# EAGLE schematic ClockV0.1 (EAGLE 6.5.0)
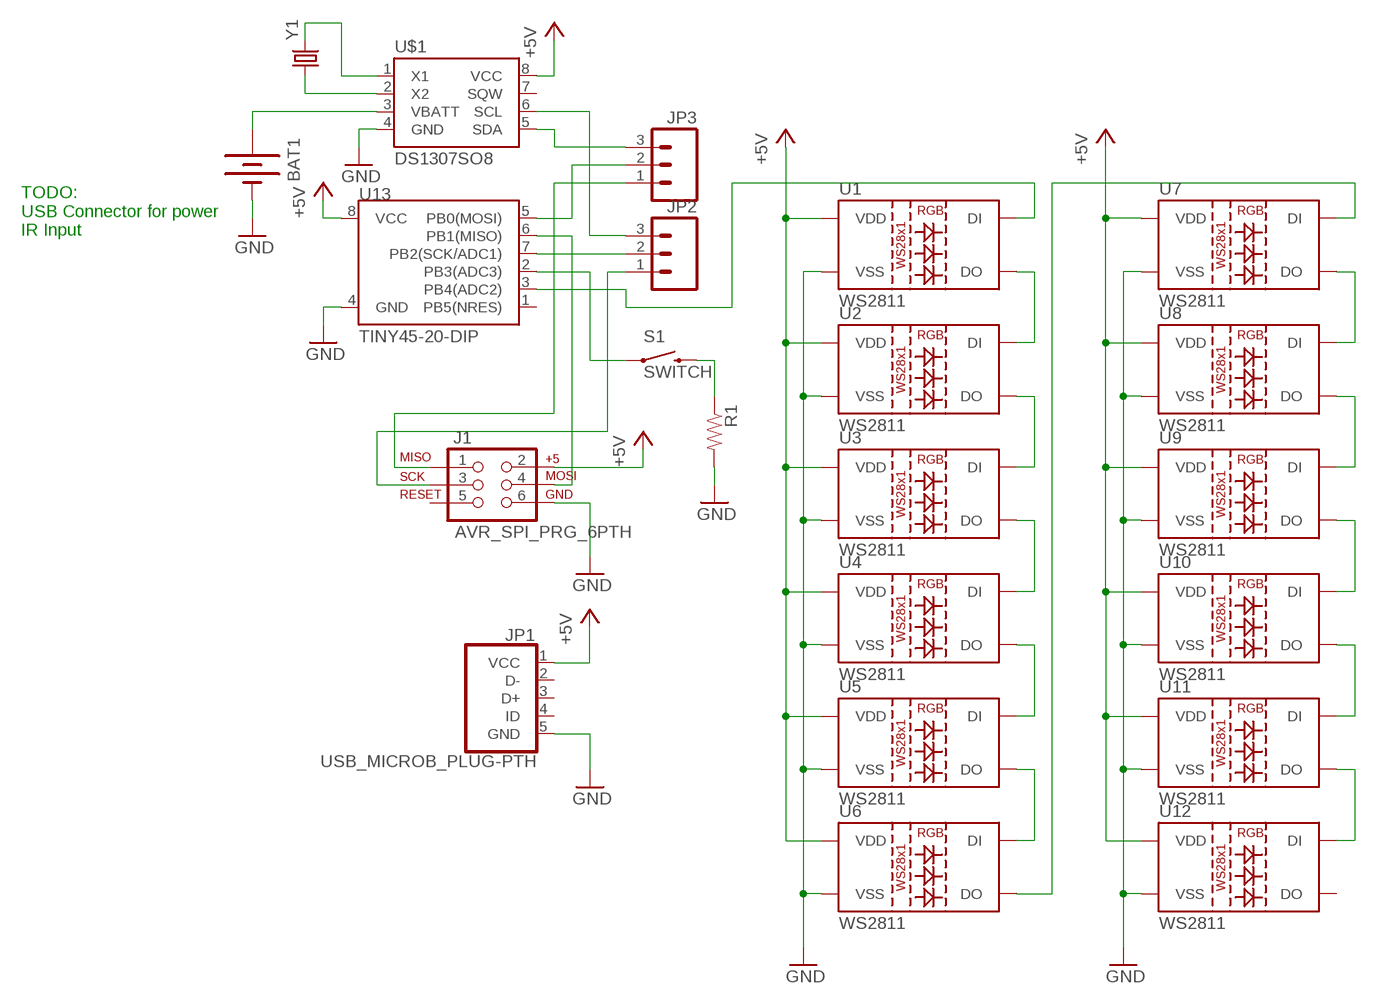
[diagram p0: schematic, sheet 1]

## Parts
BAT1  BATTERY12PTH  [BATTCON_12MM_PTH]
J1  AVR_SPI_PRG_6PTH  [2X3]
JP1  USB_MICROB_PLUG-PTH  [MICRO-B-RA-TH]
JP2  M03PTH  [1X03]
JP3  M03PTH  [1X03]
R1  RESISTORPTH-1/2W  [AXIAL-0.5]
S1  SWITCH  SWITCH-MOMENTARY-2PTH  [TACTILE-PTH]
U1  WS2811  LED-TRICOLOR-5050-ICWS2811  [LED-TRICOLOR-5050-IC]
U2  WS2811  LED-TRICOLOR-5050-ICWS2811  [LED-TRICOLOR-5050-IC]
U3  WS2811  LED-TRICOLOR-5050-ICWS2811  [LED-TRICOLOR-5050-IC]
U4  WS2811  LED-TRICOLOR-5050-ICWS2811  [LED-TRICOLOR-5050-IC]
U5  WS2811  LED-TRICOLOR-5050-ICWS2811  [LED-TRICOLOR-5050-IC]
U6  WS2811  LED-TRICOLOR-5050-ICWS2811  [LED-TRICOLOR-5050-IC]
U7  WS2811  LED-TRICOLOR-5050-ICWS2811  [LED-TRICOLOR-5050-IC]
U8  WS2811  LED-TRICOLOR-5050-ICWS2811  [LED-TRICOLOR-5050-IC]
U9  WS2811  LED-TRICOLOR-5050-ICWS2811  [LED-TRICOLOR-5050-IC]
U10  WS2811  LED-TRICOLOR-5050-ICWS2811  [LED-TRICOLOR-5050-IC]
U11  WS2811  LED-TRICOLOR-5050-ICWS2811  [LED-TRICOLOR-5050-IC]
U12  WS2811  LED-TRICOLOR-5050-ICWS2811  [LED-TRICOLOR-5050-IC]
U13  TINY45-20-DIP  ATTINY45TINY45-20-DIP  [DIP08]
U$1  DS1307SO8  [SO08]
Y1  CRYSTAL32-SMD  [CRYSTAL-32KHZ-SMD]

## Nets
+5V: J1.2 JP1.1(VCC) U1.3(VDD) U1.5(VDD) U2.3(VDD) U2.5(VDD) U3.3(VDD) U3.5(VDD) U4.3(VDD) U4.5(VDD) U5.3(VDD) U5.5(VDD) U6.3(VDD) U6.5(VDD) U7.3(VDD) U7.5(VDD) U8.3(VDD) U8.5(VDD) U9.3(VDD) U9.5(VDD) U10.3(VDD) U10.5(VDD) U11.3(VDD) U11.5(VDD) U12.3(VDD) U12.5(VDD) U13.8(VCC) U$1.8(VCC)
GND: BAT1.GND(-) J1.6 JP1.5(GND) R1.P$2 U1.6(VSS) U2.6(VSS) U3.6(VSS) U4.6(VSS) U5.6(VSS) U6.6(VSS) U7.6(VSS) U8.6(VSS) U9.6(VSS) U10.6(VSS) U11.6(VSS) U12.6(VSS) U13.4(GND) U$1.4(GND)
N$1: U7.1(DO) U8.2(DI)
N$2: U8.1(DO) U9.2(DI)
N$3: U1.1(DO) U2.2(DI)
N$4: U2.1(DO) U3.2(DI)
N$5: U3.1(DO) U4.2(DI)
N$6: U4.1(DO) U5.2(DI)
N$7: U5.1(DO) U6.2(DI)
N$8: U6.1(DO) U7.2(DI)
N$9: U9.1(DO) U10.2(DI)
N$10: U10.1(DO) U11.2(DI)
N$11: U11.1(DO) U12.2(DI)
N$12: J1.1 JP3.1
N$13: J1.4 U13.6(PB1(MISO))
N$14: U1.2(DI) U13.3(PB4(ADC2))
N$15: J1.3 JP2.1
N$16: BAT1.VCC@1(+) U$1.3(VBATT)
N$17: U$1.2(X2) Y1.X1
N$18: U$1.1(X1) Y1.X2
N$19: JP2.3 U$1.6(SCL)
N$20: JP2.2 U13.7(PB2(SCK/ADC1))
N$21: JP3.2 U13.5(PB0(MOSI))
N$22: JP3.3 U$1.5(SDA)
N$23: S1.1 U13.2(PB3(ADC3))
N$24: R1.P$1 S1.3
Unconnected: J1.5 JP1.2(D-) JP1.3(D+) JP1.4(ID) U12.1(DO) U13.1(PB5(NRES)) U$1.7(SQW)

## Notes on the sheet
- TODO:
  USB Connector for power
  IR Input

## Library data of the parts
BAT1 = SparkFun-Electromechanical:BATTERY: Battery Holders Various common sizes : AA, AAA, 20mm coin cell and 12mm coin cell. 20MM_4LEGS, BATT-10373
J1 = SparkFun-Connectors:AVR_SPI_PRG_6: AVR ISP 6 Pin This is the reduced ISP connector for AVR programming. Common on Arduino. This footprint will take up less PCB space and can be used with a 10-pin to 6-pin adapter such as SKU: BOB-08508
JP1 = SparkFun-Connectors:USB_MICROB_PLUG: USB Micro-B Plug Comes in a variety of packages. Check out Hirose's ZX-x0 line: http://www.hirose.co.jp/cataloge_hp/e24200011.pdf
JP2 JP3 = SparkFun-Connectors:M03: Header 3 Standard 3-pin 0.1" header. Use with straight break away headers (SKU : PRT-00116), right angle break away headers (PRT-00553), swiss pins (PRT-00743), machine pins (PRT-00117), and female headers (PRT-00115). Molex polarized connector foot print use with SKU : PRT-08232 with associated crimp pins and housings.
R1 = SparkFun-Passives:RESISTOR: Resistor Basic schematic elements and footprints for 0603, 1206, and PTH resistors.
S1 = SparkFun-Electromechanical:SWITCH-MOMENTARY-2: Various NO switches- pushbuttons, reed, etc
U1-U12 = SparkFun-LED:LED-TRICOLOR-5050-IC: WS2811 RGB LED w/driver 5x5mm SMD LED with built-in controller IC. DIO-11598; PROD_ID: DIO-11598
U13 = SparkFun-DigitalIC:ATTINY45: Atmel 8-pin 2/4/8kB flash uC; PROD_ID: IC-09439
U$1 = SparkFun-FreqCtrl:DS1307: I2C real-time clock with battery backup.
Y1 = SparkFun-FreqCtrl:CRYSTAL: Various standard crystals. Proven footprints. Spark Fun Electronics SKU : COM-00534; PROD_ID: XTAL-07894